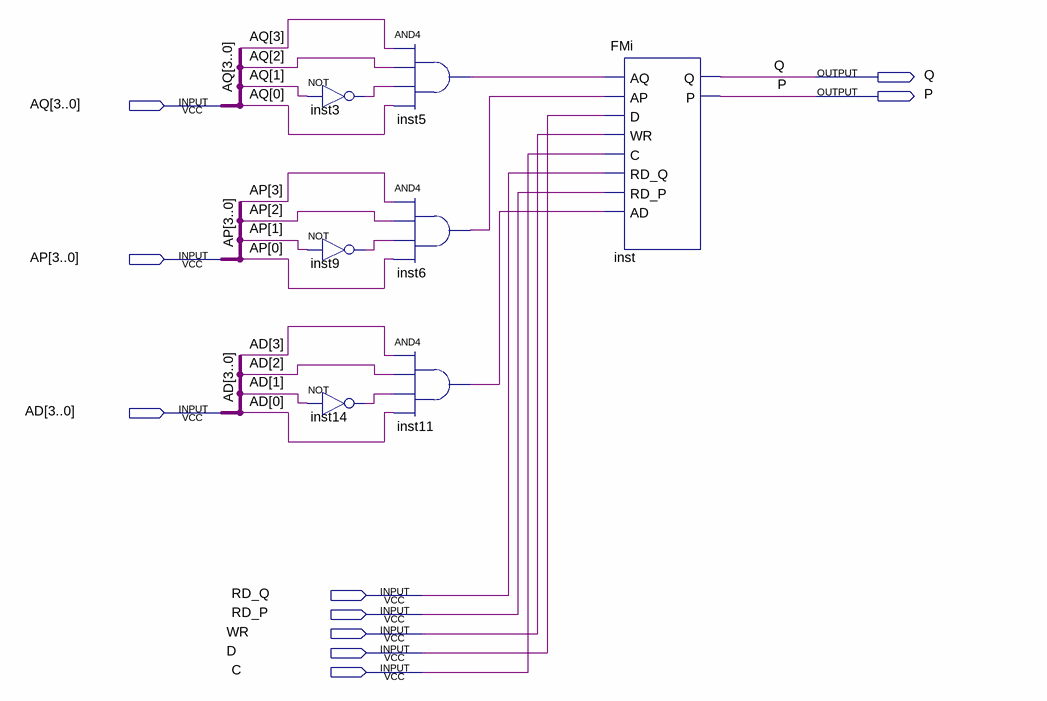
[diagram p0: schematic sheet]
// Quartus schematic FM1101.bdf as structural Verilog: 7 symbols, 10 pins
module FM1101 (
  input  [3:0] AQ,
  input  [3:0] AP,
  input  [3:0] AD,
  input  RD_Q,
  input  RD_P,
  input  WR,
  input  D,
  input  C,
  output Q,
  output P
);

  wire inst3_out, inst5_out, inst6_out, inst9_out, inst11_out, inst14_out;

  not inst3 (inst3_out, AQ[1]);
  not inst9 (inst9_out, AP[1]);
  not inst14 (inst14_out, AD[1]);
  and inst5 (inst5_out, AQ[3], AQ[2], inst3_out, AQ[0]);
  and inst6 (inst6_out, AP[3], AP[2], inst9_out, AP[0]);
  and inst11 (inst11_out, AD[3], AD[2], inst14_out, AD[0]);
  FMi inst (
    .AQ(inst5_out), .AP(inst6_out), .D(D), .WR(WR), .C(C), .RD_Q(RD_Q), .RD_P(RD_P), .AD(inst11_out), .Q(Q),
    .P(P));
endmodule
